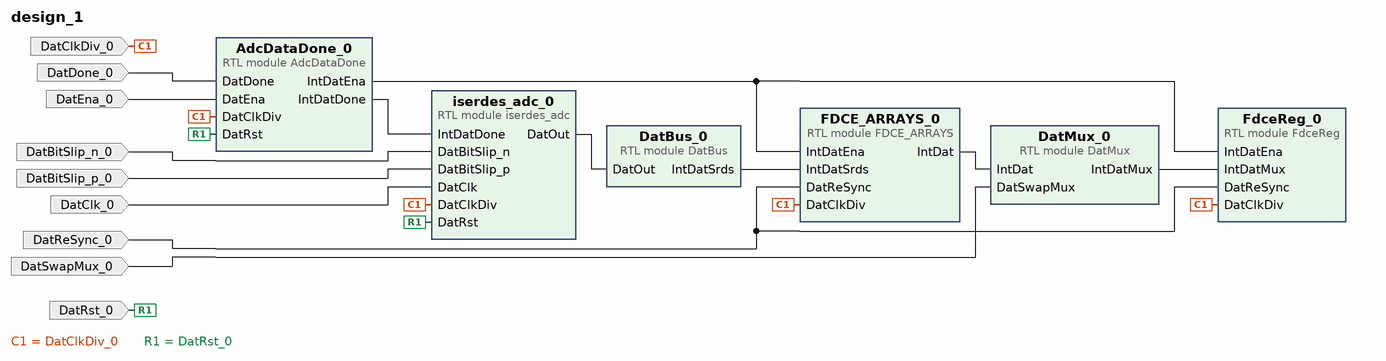
[diagram p0: block diagram of the top level]
# Vivado block design design_1, xc7z020clg400-1, Vivado 2022.2
create_bd_design design_1

create_bd_port -dir I DatRst_0
create_bd_port -dir I DatBitSlip_p_0
create_bd_port -dir I DatBitSlip_n_0
create_bd_port -dir I DatClk_0
create_bd_port -dir I DatClkDiv_0
create_bd_port -dir I DatDone_0
create_bd_port -dir I DatEna_0
create_bd_port -dir I DatReSync_0
create_bd_port -dir I DatSwapMux_0

create_bd_cell -type module -reference AdcDataDone AdcDataDone_0
create_bd_cell -type module -reference DatBus DatBus_0
create_bd_cell -type module -reference FDCE_ARRAYS FDCE_ARRAYS_0
create_bd_cell -type module -reference DatMux DatMux_0
create_bd_cell -type module -reference FdceReg FdceReg_0
create_bd_cell -type module -reference iserdes_adc iserdes_adc_0

# ---- connections ----

connect_bd_net [get_bd_pins AdcDataDone_0/IntDatDone] [get_bd_pins iserdes_adc_0/IntDatDone]
connect_bd_net [get_bd_pins AdcDataDone_0/IntDatEna] [get_bd_pins FDCE_ARRAYS_0/IntDatEna] [get_bd_pins FdceReg_0/IntDatEna]
connect_bd_net -net DatBitSlip_n_0_1 [get_bd_ports DatBitSlip_n_0] [get_bd_pins iserdes_adc_0/DatBitSlip_n]
connect_bd_net -net DatBitSlip_p_0_1 [get_bd_ports DatBitSlip_p_0] [get_bd_pins iserdes_adc_0/DatBitSlip_p]
connect_bd_net [get_bd_pins DatBus_0/IntDatSrds] [get_bd_pins FDCE_ARRAYS_0/IntDatSrds]
connect_bd_net -net DatClkDiv_0_1 [get_bd_ports DatClkDiv_0] \
  [get_bd_pins AdcDataDone_0/DatClkDiv] [get_bd_pins FDCE_ARRAYS_0/DatClkDiv] [get_bd_pins FdceReg_0/DatClkDiv] \
  [get_bd_pins iserdes_adc_0/DatClkDiv]
connect_bd_net -net DatClk_0_1 [get_bd_ports DatClk_0] [get_bd_pins iserdes_adc_0/DatClk]
connect_bd_net -net DatDone_0_1 [get_bd_ports DatDone_0] [get_bd_pins AdcDataDone_0/DatDone]
connect_bd_net -net DatEna_0_1 [get_bd_ports DatEna_0] [get_bd_pins AdcDataDone_0/DatEna]
connect_bd_net [get_bd_pins DatMux_0/IntDatMux] [get_bd_pins FdceReg_0/IntDatMux]
connect_bd_net -net DatReSync_0_1 [get_bd_ports DatReSync_0] [get_bd_pins FDCE_ARRAYS_0/DatReSync] [get_bd_pins FdceReg_0/DatReSync]
connect_bd_net -net DatRst_0_1 [get_bd_ports DatRst_0] [get_bd_pins AdcDataDone_0/DatRst] [get_bd_pins iserdes_adc_0/DatRst]
connect_bd_net -net DatSwapMux_0_1 [get_bd_ports DatSwapMux_0] [get_bd_pins DatMux_0/DatSwapMux]
connect_bd_net [get_bd_pins FDCE_ARRAYS_0/IntDat] [get_bd_pins DatMux_0/IntDat]
connect_bd_net [get_bd_pins iserdes_adc_0/DatOut] [get_bd_pins DatBus_0/DatOut]

validate_bd_design
save_bd_design
